# EasyEDA Pro project esp32car.eprj

# Schematic Schematic1
Board Name: Board1; Create Date: 2025-06-29; Page Name: P1; Project Name: esp32car; Schematic Name: Schematic1; Update Date: 2025-07-07; Company: EasyEDA.com; Page Size: A4; Version: V1.0
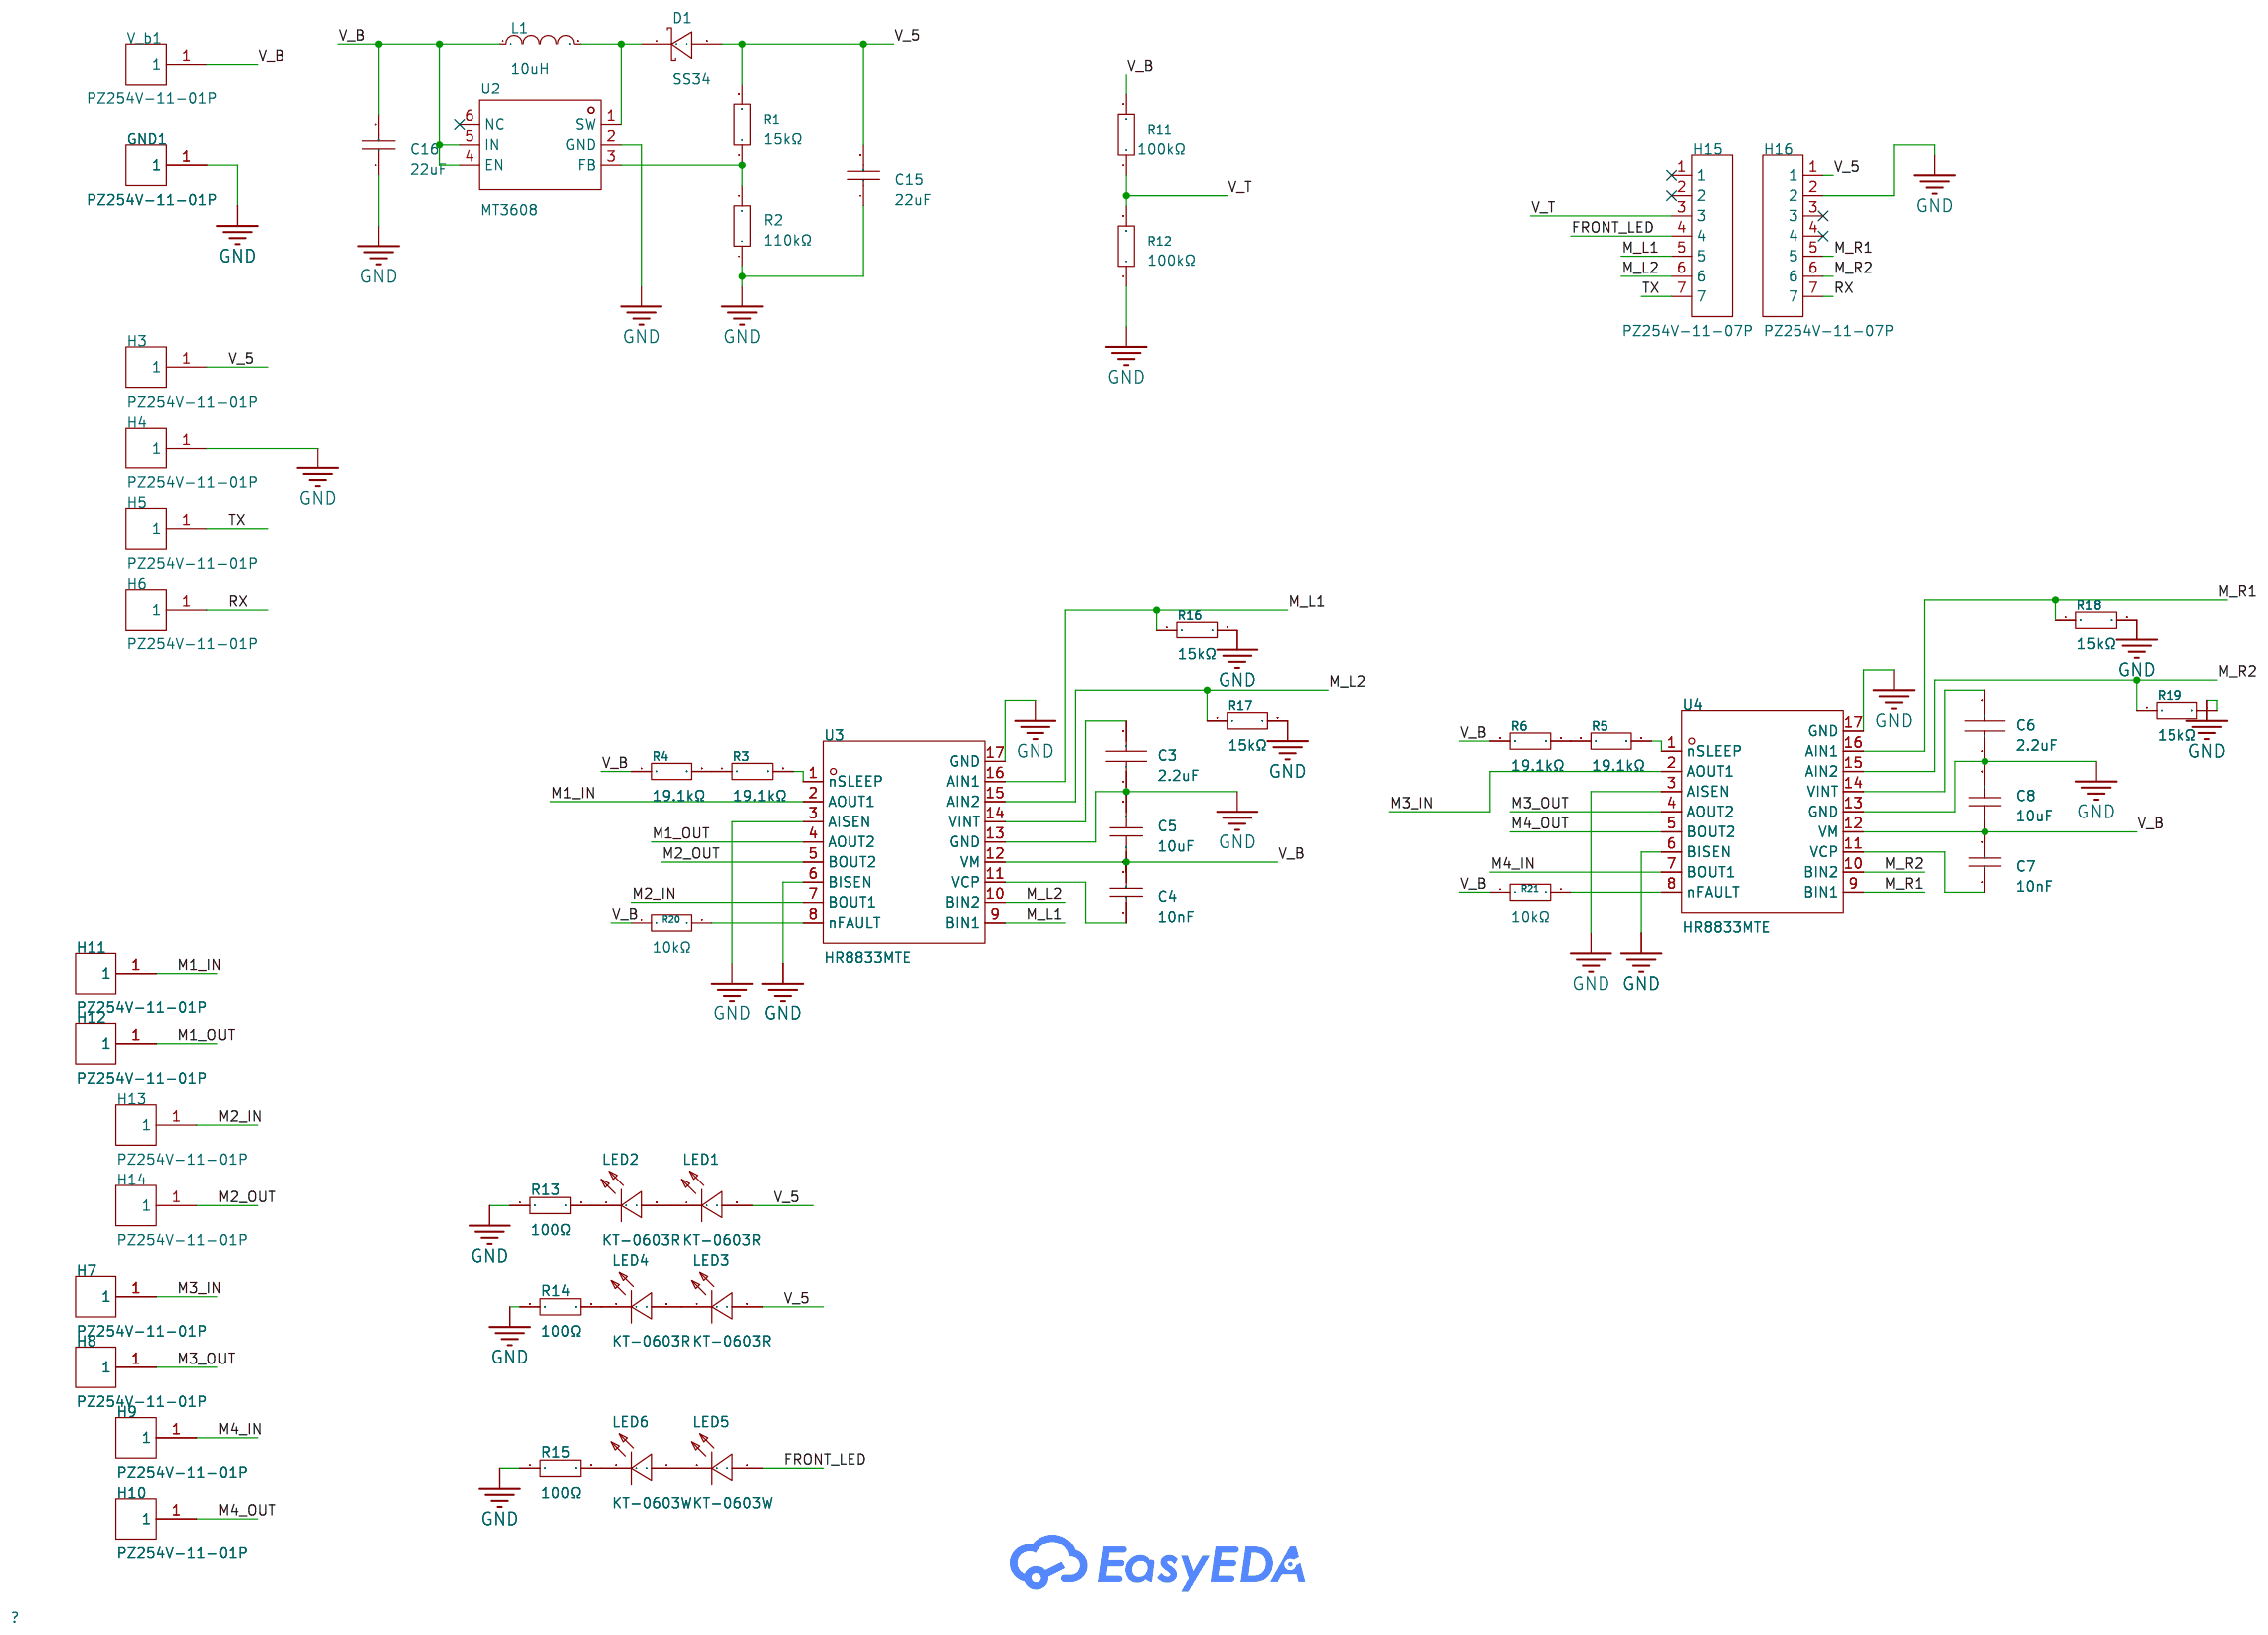
[diagram p0: schematic sheet]

## Parts
C3  2.2uF  [C0402]
C4  10nF  [C0402]
C5  10uF  [C0603]
C6  2.2uF  [C0402]
C7  10nF  [C0402]
C8  10uF  [C0603]
C15  22uF  [C1206]
C16  22uF  [C1206]
D1  SS34  [SMA_L4.3-W2.6-LS5.2-RD]
GND1  PZ254V-11-01P  [TESTPOINT-SMD_BD2.0-H10.5]
H3  PZ254V-11-01P  [TESTPOINT-SMD_BD2.0-H10.5]
H4  PZ254V-11-01P  [TESTPOINT-SMD_BD2.0-H10.5]
H5  PZ254V-11-01P  [TESTPOINT-SMD_BD2.0-H10.5]
H6  PZ254V-11-01P  [TESTPOINT-SMD_BD2.0-H10.5]
H7  PZ254V-11-01P  [TESTPOINT-SMD_BD2.0-H10.5]
H8  PZ254V-11-01P  [TESTPOINT-SMD_BD2.0-H10.5]
H9  PZ254V-11-01P  [TESTPOINT-SMD_BD2.0-H10.5]
H10  PZ254V-11-01P  [TESTPOINT-SMD_BD2.0-H10.5]
H11  PZ254V-11-01P  [TESTPOINT-SMD_BD2.0-H10.5]
H12  PZ254V-11-01P  [TESTPOINT-SMD_BD2.0-H10.5]
H13  PZ254V-11-01P  [TESTPOINT-SMD_BD2.0-H10.5]
H14  PZ254V-11-01P  [TESTPOINT-SMD_BD2.0-H10.5]
H15  PZ254V-11-07P  [HDR-TH_7P-P2.54-V-M]
H16  PZ254V-11-07P  [HDR-TH_7P-P2.54-V-M]
L1  10uH  [L1008]
LED1  KT-0603R  [LED0603-RD]
LED2  KT-0603R  [LED0603-RD]
LED3  KT-0603R  [LED0603-RD]
LED4  KT-0603R  [LED0603-RD]
LED5  KT-0603W  [LED0603-R-RD_WHITE]
LED6  KT-0603W  [LED0603-R-RD_WHITE]
R1  15kΩ  [R0402]
R2  110kΩ  [R0603]
R3  19.1kΩ  [R0402]
R4  19.1kΩ  [R0402]
R5  19.1kΩ  [R0402]
R6  19.1kΩ  [R0402]
R11  100kΩ  [R0402]
R12  100kΩ  [R0402]
R13  100Ω  [R0402]
R14  100Ω  [R0402]
R15  100Ω  [R0402]
R16  15kΩ  [R0402]
R17  15kΩ  [R0402]
R18  15kΩ  [R0402]
R19  15kΩ  [R0402]
R20  10kΩ  [R0603]
R21  10kΩ  [R0603]
U2  MT3608  [SOT-23-6_L2.9-W1.6-P0.95-LS2.8-BL]
U3  HR8833MTE  [TSSOP-16_L5.0-W4.4-P0.65-LS6.4-BL-EP3.0]
U4  HR8833MTE  [TSSOP-16_L5.0-W4.4-P0.65-LS6.4-BL-EP3.0]
V_b1  PZ254V-11-01P  [TESTPOINT-SMD_BD2.0-H10.5]

## Library data of the parts
C3 C6 = CL05A225MQ5NSNC: Capacitance: Tolerance:±20% Tolerance:±20% Voltage Rated: Temperature Coefficient:; LCSC Part Name: 2.2uF ±20% 6.3V; Supplier Part: C12530; Manufacturer: SAMSUNG(三星); Supplier Footprint: 0402; JLCPCB Part Class: Basic Part; Datasheet: https://atta.szlcsc.com/upload/public/pdf/source/20160218/1457707763339.pdf; Supplier: LCSC; Tolerance: ±20%; Check: true
C4 C7 = CL05B103KB5NNNC: Capacitance: Tolerance:±10% Tolerance:±10% Voltage Rated: Temperature Coefficient:; LCSC Part Name: 10nF ±10% 50V; Supplier Part: C15195; Manufacturer: SAMSUNG(三星); Supplier Footprint: 0402; JLCPCB Part Class: Basic Part; Datasheet: https://atta.szlcsc.com/upload/public/pdf/source/20160218/1457707763339.pdf; Supplier: LCSC; Tolerance: ±10%; Check: true
C5 C8 = CL10A106KP8NNNC: Capacitance: Tolerance:±10% Tolerance:±10% Voltage Rated: Temperature Coefficient:; LCSC Part Name: 10uF ±10% 10V; Supplier Part: C19702; Manufacturer: SAMSUNG(三星); Supplier Footprint: 0603; JLCPCB Part Class: Basic Part; Datasheet: https://atta.szlcsc.com/upload/public/pdf/source/20160218/1457707763339.pdf; Supplier: LCSC; Tolerance: ±10%; Check: true
C15 C16 = 1206X226K100NT: Capacitance:22uF Tolerance:±10% Tolerance:±10% Voltage Rating:10V Temperature Coefficient:X5R; LCSC Part Name: 22uF ±10% 10V; Supplier Part: C1859; Manufacturer: FH(风华); Supplier Footprint: 1206; JLCPCB Part Class: Extended Part; Datasheet: https://atta.szlcsc.com/upload/public/pdf/source/20200305/C486355_26A10D38EF8C2A5C37091D0039909270.pdf; Supplier: LCSC; Tolerance: ±10%; Voltage Rating: 10V; Temperature Coefficient: X5R; Check: true
D1 = SS34_C8678: Diode Configuration:Independent Type Forward Voltage (Vf@If):550mV@3A Reverse Voltage (Vr):40V Rectified Current:3A Reverse Leakage Current (Ir):500uA@40V; LCSC Part Name: 电压:40V 电流:3A; Supplier Part: C8678; Manufacturer: MDD(辰达半导体); Supplier Footprint: SMA(DO-214AC); JLCPCB Part Class: Basic Part; Datasheet: https://atta.szlcsc.com/upload/public/pdf/source/20240710/2118BB86FDDB2E0B294389AC1F3F65C8.pdf; Supplier: LCSC; Diode Configuration: Independent Type; Forward Voltage (Vf@If): 550mV@3A; Reverse Voltage (Vr): 40V; Rectified Current: 3A; Reverse Leakage Current (Ir): 500uA@40V; Check: true
GND1 H3-H14 V_b1 = PZ254V-11-01P: Pin Structure:1x1P Pitch:2.54mm Row Spacing:- Circluar Pins/Square Pins:Policy Mounting Type:Straight Number of Rows:Single Row Number of Pins:1P Current Rating:- Voltage Rating (Max):- Length of Mating Pin:6mm Insulation Height:2.5mm Length of End Connec; LCSC Part Name: 1x1P 间距:2.54mm 方针 直插; Supplier Part: C492400; Manufacturer: XFCN(兴飞); Supplier Footprint: 插件,P=2.54mm; JLCPCB Part Class: Extended Part; Datasheet: https://atta.szlcsc.com/upload/public/pdf/source/20200309/C492400_46876A5B545F5AE6B8D4A09C46E276E8.pdf; Supplier: LCSC; Pin Structure: 1x1P; Pitch: 2.54mm; Circluar Pins/Square Pins: Policy; Mounting Type: Straight; Number of Rows: Single Row; Number of Pins: 1P; Length of Mating Pin: 6mm; Insulation Height: 2.5mm; Length of End Connection Pin: 3mm; Contact Material: Brass; Operating Temperature: -40℃~+105℃; Color: Black; Check: true
H15 H16 = PZ254V-11-07P: Pin Structure:1x7P Pitch:2.54mm Row Spacing:- Circluar Pins/Square Pins:Policy Mounting Type:Straight Number of Rows:Single Row Number of Pins:7P Current Rating:- Voltage Rating (Max):- Length of Mating Pin:6mm Insulation Height:2.5mm Length of End Connec; LCSC Part Name: 1x7P 间距:2.54mm 方针 直插; Supplier Part: C492406; Manufacturer: XFCN(兴飞); Supplier Footprint: 插件,P=2.54mm; JLCPCB Part Class: Extended Part; Datasheet: https://atta.szlcsc.com/upload/public/pdf/source/20200309/C492406_654C533EE691117E22DD9F76C114C2D9.pdf; Supplier: LCSC; Pin Structure: 1x7P; Pitch: 2.54mm; Circluar Pins/Square Pins: Policy; Mounting Type: Straight; Number of Rows: Single Row; Number of Pins: 7P; Length of Mating Pin: 6mm; Insulation Height: 2.5mm; Length of End Connection Pin: 3mm; Contact Material: Brass; Operating Temperature: -40℃~+105℃; Color: Black; Check: true
L1 = MLP2520S100MT0S1: Inductance: Tolerance:±20% Tolerance:±20% Rated Current: Saturation Current (Isat):- DC Resistance (DCR): Q @ Freq:- Frequency - Self Resonant:- Ratings:; LCSC Part Name: 10uH ±20%; Supplier Part: C191565; Manufacturer: TDK; Supplier Footprint: 1008; JLCPCB Part Class: Extended Part; Datasheet: https://atta.szlcsc.com/upload/public/pdf/source/20180509/C191565_96EFA22247937AC23482DD539EC5BC50.pdf; Supplier: LCSC; Tolerance: ±20%; Check: true
LED1-LED4 = KT-0603R: Emitted Color:Red Power Dissipation:- Forward Current:- Dominant Wavelength:- Dominant Wavelength:- Peak Wavelength:- Diode Configuration:- Lens Color:- Color Temperature:- Color Temperature:- Viewing Angle:- Mounting Sytle:- Operating Temperature:-40℃~+8; LCSC Part Name: 0603 红灯 高亮; Supplier Part: C2286; Manufacturer: KENTO; Supplier Footprint: 0603; JLCPCB Part Class: Basic Part; Datasheet: https://atta.szlcsc.com/upload/public/pdf/source/20160616/1466072038404.pdf; Supplier: LCSC; Emitted Color: Red; Operating Temperature: -40℃~+85℃; Check: true
LED5 LED6 = KT-0603W: Emitted Color:White; LCSC Part Name: 0603 白灯 高亮; Supplier Part: C2290; Manufacturer: KENTO; Supplier Footprint: 0603; JLCPCB Part Class: Basic Part; Datasheet: https://atta.szlcsc.com/upload/public/pdf/source/20221101/4C23D5C85BA051E44A00B833D0A41468.pdf; Supplier: LCSC; Emitted Color: White; Check: true
R1 R16-R19 = 0402WGF1502TCE: Type:Thick Film Resistors Resistance:15kΩ Tolerance:±1% Tolerance:±1% Power(Watts): Overload Voltage (Max): Temperature Coefficient:±100ppm/℃ Temperature Coefficient:±100ppm/℃ Operating Temperature Range:-55℃~+155℃ Operating Temperature Range:-55℃~+155℃; LCSC Part Name: 15kΩ ±1% 62.5mW 厚膜电阻; Supplier Part: C25756; Manufacturer: UNI-ROYAL(厚声); Supplier Footprint: 0402; JLCPCB Part Class: Basic Part; Datasheet: https://atta.szlcsc.com/upload/public/pdf/source/20200306/C422600_1E6D84923E4A46A82E41ADD87F860B5C.pdf; Supplier: LCSC; Type: Thick Film Resistors; Tolerance: ±1%; Temperature Coefficient: ±100ppm/℃; Operating Temperature Range: -55℃~+155℃; Check: true
R2 = 0603WAF1103T5E: Type:Thick Film Resistors Resistance:110kΩ Tolerance:±1% Tolerance:±1% Power(Watts): Overload Voltage (Max): Temperature Coefficient:±100ppm/℃ Temperature Coefficient:±100ppm/℃ Operating Temperature Range:-55℃~+155℃ Operating Temperature Range:-55℃~+155℃; LCSC Part Name: 110kΩ ±1% 100mW 厚膜电阻; Supplier Part: C25805; Manufacturer: UNI-ROYAL(厚声); Supplier Footprint: 0603; JLCPCB Part Class: Extended Part; Datasheet: https://atta.szlcsc.com/upload/public/pdf/source/20200306/C422600_1E6D84923E4A46A82E41ADD87F860B5C.pdf; Supplier: LCSC; Type: Thick Film Resistors; Tolerance: ±1%; Temperature Coefficient: ±100ppm/℃; Operating Temperature Range: -55℃~+155℃; Check: true
R3-R6 = 0402WGF1912TCE: Type:Thick Film Resistors Resistance:19.1kΩ Tolerance:±1% Tolerance:±1% Power(Watts): Overload Voltage (Max): Temperature Coefficient:±100ppm/℃ Temperature Coefficient:±100ppm/℃ Operating Temperature Range:-55℃~+155℃ Operating Temperature Range:-55℃~+155℃; LCSC Part Name: 19.1kΩ ±1% 62.5mW 厚膜电阻; Supplier Part: C52036; Manufacturer: UNI-ROYAL(厚声); Supplier Footprint: 0402; JLCPCB Part Class: Extended Part; Datasheet: https://atta.szlcsc.com/upload/public/pdf/source/20200306/C422600_1E6D84923E4A46A82E41ADD87F860B5C.pdf; Supplier: LCSC; Type: Thick Film Resistors; Tolerance: ±1%; Temperature Coefficient: ±100ppm/℃; Operating Temperature Range: -55℃~+155℃; Check: true
R11 R12 = 0402WGF1003TCE: Type:Thick Film Resistors Resistance:100kΩ Tolerance:±1% Tolerance:±1% Power(Watts): Overload Voltage (Max): Temperature Coefficient:±100ppm/℃ Temperature Coefficient:±100ppm/℃ Operating Temperature Range:-55℃~+155℃ Operating Temperature Range:-55℃~+155℃; LCSC Part Name: 100kΩ ±1% 62.5mW 厚膜电阻; Supplier Part: C25741; Manufacturer: UNI-ROYAL(厚声); Supplier Footprint: 0402; JLCPCB Part Class: Basic Part; Datasheet: https://atta.szlcsc.com/upload/public/pdf/source/20200306/C422600_1E6D84923E4A46A82E41ADD87F860B5C.pdf; Supplier: LCSC; Type: Thick Film Resistors; Tolerance: ±1%; Temperature Coefficient: ±100ppm/℃; Operating Temperature Range: -55℃~+155℃; Check: true
R13-R15 = 0402WGF1000TCE: Type:Thick Film Resistors Resistance: Tolerance:±1% Tolerance:±1% Power(Watts): Overload Voltage (Max): Temperature Coefficient:±200ppm/℃ Temperature Coefficient:±200ppm/℃ Operating Temperature Range:-55℃~+155℃ Operating Temperature Range:-55℃~+155℃; LCSC Part Name: 100Ω ±1% 62.5mW 厚膜电阻; Supplier Part: C25076; Manufacturer: UNI-ROYAL(厚声); Supplier Footprint: 0402; JLCPCB Part Class: Basic Part; Datasheet: https://atta.szlcsc.com/upload/public/pdf/source/20200306/C422600_1E6D84923E4A46A82E41ADD87F860B5C.pdf; Supplier: LCSC; Type: Thick Film Resistors; Tolerance: ±1%; Temperature Coefficient: ±200ppm/℃; Operating Temperature Range: -55℃~+155℃; Check: true
R20 R21 = 0603WAF1002T5E: LCSC Part Name: 厚膜电阻 10kΩ ±1% 100mW; Supplier Part: C25804; Manufacturer: UNI-ROYAL(厚声); Supplier Footprint: 0603; JLCPCB Part Class: Basic Part; Datasheet: https://atta.szlcsc.com/upload/public/pdf/source/20200306/C422600_1E6D84923E4A46A82E41ADD87F860B5C.pdf; Supplier: LCSC; Type: Thick Film Resistor; Tolerance: ±1%; Power(Watts): 100mW; Voltage-Supply(Max): 75V; Temperature Coefficient: ±100ppm/℃; Operating Temperature: -55℃~+155℃
U2 = MT3608: Function:Boost type Output Type:Adjustable Input Voltage:2V~24V Input Voltage:2V~24V Output Voltage:28V Output Voltage:28V Output Current:2A Switching Frequency:1.2MHz Switching Frequency:1.2MHz Operating Temperature:-40℃~+85℃ Operating Temperature:-40℃~+; LCSC Part Name: 高效1.2MHz 2A升压转换器; Supplier Part: C84817; Manufacturer: 西安航天民芯; Supplier Footprint: SOT-23-6; JLCPCB Part Class: Extended Part; Datasheet: https://atta.szlcsc.com/upload/public/pdf/source/20161110/1478743351706.pdf; Supplier: LCSC; Function: Boost type; Output Type: Adjustable; Input Voltage: 2V~24V; Output Voltage: 28V; Output Current: 2A; Switching Frequency: 1.2MHz; Operating Temperature: -40℃~+85℃; Synchronous Rectification: No; Number of Outputs: 1; Topology: Boost; Quiescent Current (Iq): 200uA; Switch tube (built-in/external): Built-in; Check: true
U3 U4 = HR8833MTE: Supplier Part: C128666; Manufacturer: 嘉兴禾润; Supplier Footprint: TSSOP-16-EP; JLCPCB Part Class: Extended Part; Supplier: LCSC; Check: true

## Nets
GND: C3.1 C5.2 C6.1 C8.2 C15.1 C16.1 GND1.1 H4.1 H16.2 R2.1 R12.1 R13.1 R14.1 R15.1 R16.2 R17.2 R18.2 R19.2 U2.2(GND) U3.3(AISEN) U3.6(BISEN) U3.13(GND) U3.17(GND) U4.3(AISEN) U4.6(BISEN) U4.13(GND) U4.17(GND)
FRONT_LED: H15.4 LED5.1(A)
M1_IN: H11.1 U3.2(AOUT1)
M1_OUT: H12.1 U3.4(AOUT2)
M2_IN: H13.1 U3.7(BOUT1)
M2_OUT: H14.1 U3.5(BOUT2)
M3_IN: H7.1 U4.2(AOUT1)
M3_OUT: H8.1 U4.4(AOUT2)
M4_IN: H9.1 U4.7(BOUT1)
M4_OUT: H10.1 U4.5(BOUT2)
M_L1: H15.5 R16.1 U3.9(BIN1) U3.16(AIN1)
M_L2: H15.6 R17.1 U3.10(BIN2) U3.15(AIN2)
M_R1: H16.5 R18.1 U4.9(BIN1) U4.16(AIN1)
M_R2: H16.6 R19.1 U4.10(BIN2) U4.15(AIN2)
RX: H6.1 H16.7
TX: H5.1 H15.7
V_5: C15.2 D1.2(A) H3.1 H16.1 LED1.2(A) LED3.2(A) R1.2
V_B: C4.2 C5.1 C7.2 C8.1 C16.2 L1.1 R4.1 R6.1 R11.2 R20.1 R21.1 U2.4(EN) U2.5(IN) U3.12(VM) U4.12(VM) V_b1.1
V_T: H15.3 R11.1 R12.2
$1N6631: R3.2 U3.1(nSLEEP)
$1N6635: R1.1 R2.2 U2.3(FB)
$1N6637: R3.1 R4.2
$1N6639: C3.2 U3.14(VINT)
$1N6644: C4.1 U3.11(VCP)
$1N6652: R5.1 R6.2
$1N6659: R5.2 U4.1(nSLEEP)
$1N6698: LED4.1(K) R14.2
$1N6699: LED3.1(K) LED4.2(A)
$1N6700: LED1.1(K) LED2.2(A)
$1N6701: LED2.1(K) R13.2
$1N6705: LED6.2(K) R15.2
$1N6706: LED5.2(K) LED6.1(A)
$1N6742: C7.1 U4.11(VCP)
$1N6743: C6.2 U4.14(VINT)
$1N6745: D1.1(K) L1.2 U2.1(SW)
$1N6882: R20.2 U3.8(nFAULT)
$1N6931: R21.2 U4.8(nFAULT)

Not connected (* = marked no-connect by the designer): H15 1* 2*; H16 3* 4*; U2 6(NC)*

# Board PCB1
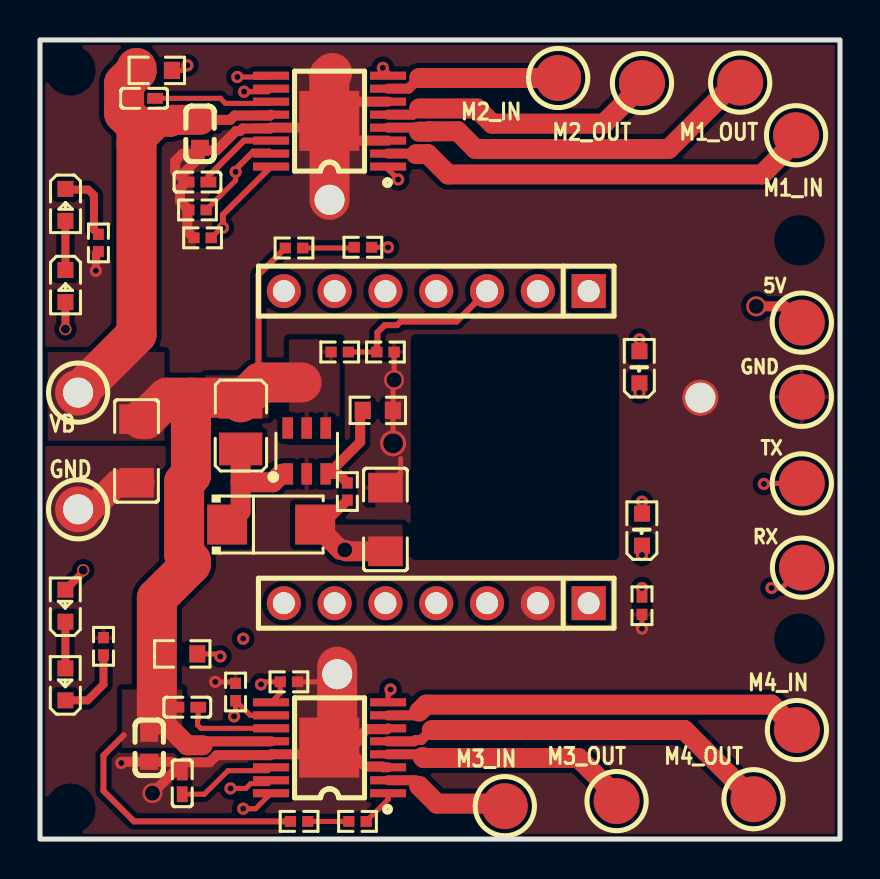
[diagram p1: board, top side]
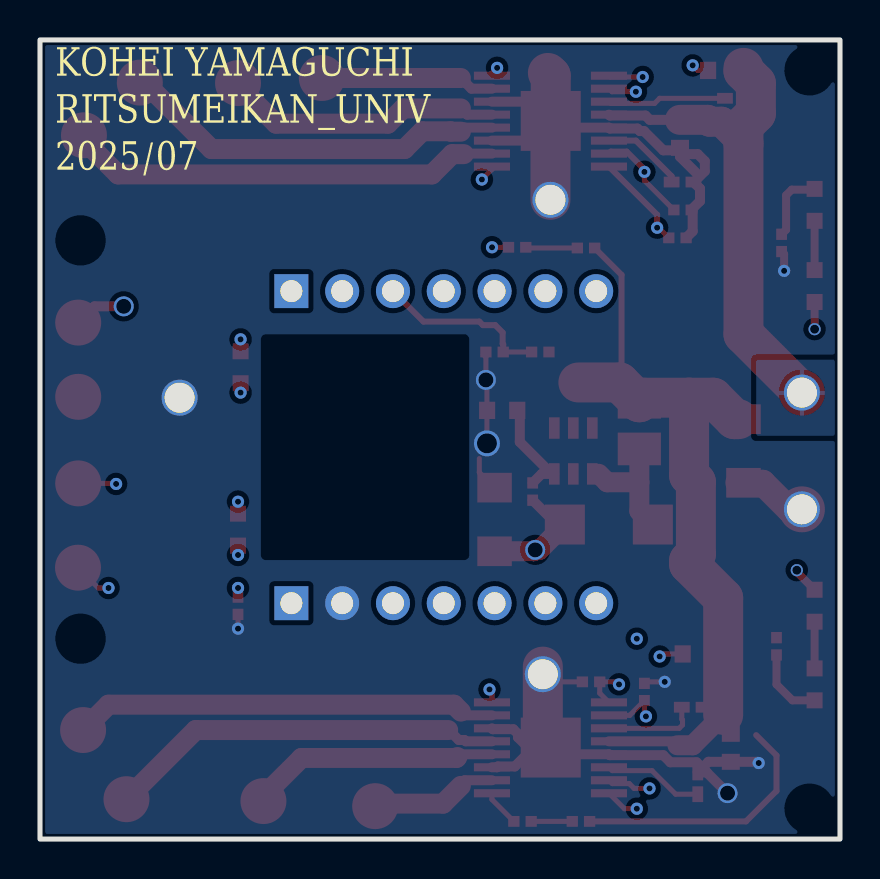
[diagram p2: board, bottom side, seen from below]

Outline 40 x 40 mm; copper layers: Top Layer, Inner1, Inner2, Bottom Layer. Coordinates in mm from the lower left corner of the outline.
Outline path: rectangle 0,40 40,0
Stack: Top Layer 0.035mm Outer layer thickness 1oz / Dielectric1 0.2104mm 7628 RC49% 8.6mil / Inner1 0.0152mm Inner layer thickness / Dielectric2 1.065mm 1.1mm H/HOZ Copper / Inner2 0.0152mm Inner layer thickness / Dielectric3 0.2104mm 7628 RC49% 8.6mil / Bottom Layer 0.035mm Outer layer thickness 1oz

## Design rules (mm)
template: JLCPCB Capability(Two Layers Board)
spacing copperThickness1oz (default): track to track 0.102, other pairs 0.152 to 0.3
spacing copperThickness2oz: track to track 0.203, other pairs 0.152 to 0.3
track width copperThickness1oz (default): min 0.127, default 0.254, max 2.54
track width copperThickness2oz: min 0.203, default 0.254, max 2.54
differential pair differentialPair (default): width min 0.127, default 0.254, max 2.54; gap min 0.152, default 0.152
via viaSize (default): diameter min 0.5, default 0.61, max 10; hole min 0.3, default 0.305, max 6.3

## Placement (name value [footprint] x y rotation side)
5V  PZ254V-11-01P  [TESTPOINT-SMD_BD2.0-H10.5]  38.09 25.85 0 top
C3  2.2uF  [C0402]  7.87 32.89 0 top
C4  10nF  [C0402]  5.21 37.08 180 top
C5  10uF  [C0603]  8 35.3 270 top
C6  2.2uF  [C0402]  7.11 2.79 270 top
C7  10nF  [C0402]  7.37 6.6 180 top
C8  10uF  [C0603]  5.46 4.57 270 top
C15  22uF  [C1206]  17.27 16 270 top
C16  22uF  [C1206]  4.83 19.43 90 top
D1  SS34  [SMA_L4.3-W2.6-LS5.2-RD]  11.56 15.74 0 top
GND  PZ254V-11-01P  [TESTPOINT-SMD_BD2.0-H10.5]  38.09 22.14 0 top
GND1  PZ254V-11-01P  [TESTPOINT-SMD_BD2.0-H10.5]  1.91 16.5 0 top
H7  PZ254V-11-01P  [TESTPOINT-SMD_BD2.0-H10.5]  23.24 1.65 0 top
H8  PZ254V-11-01P  [TESTPOINT-SMD_BD2.0-H10.5]  28.83 1.9 0 top
H9  PZ254V-11-01P  [TESTPOINT-SMD_BD2.0-H10.5]  37.85 5.46 0 top
H10  PZ254V-11-01P  [TESTPOINT-SMD_BD2.0-H10.5]  35.68 1.99 0 top
H11  PZ254V-11-01P  [TESTPOINT-SMD_BD2.0-H10.5]  37.8 35.23 0 top
H12  PZ254V-11-01P  [TESTPOINT-SMD_BD2.0-H10.5]  35.01 37.86 0 top
H13  PZ254V-11-01P  [TESTPOINT-SMD_BD2.0-H10.5]  25.91 38.09 0 top
H14  PZ254V-11-01P  [TESTPOINT-SMD_BD2.0-H10.5]  30.1 37.84 0 top
H15  PZ254V-11-07P  [HDR-TH_7P-P2.54-V-M]  19.81 27.43 180 top
H16  PZ254V-11-07P  [HDR-TH_7P-P2.54-V-M]  19.81 11.81 180 top
L1  10uH  [L1008]  10.03 20.7 270 top
LED1  KT-0603R  [LED0603-RD]  1.27 11.68 90 top
LED2  KT-0603R  [LED0603-RD]  1.27 7.74 90 top
LED3  KT-0603R  [LED0603-RD]  1.27 27.68 270 top
LED4  KT-0603R  [LED0603-RD]  1.27 31.74 270 top
LED5  KT-0603W  [LED0603-R-RD_WHITE]  29.97 23.62 90 top
LED6  KT-0603W  [LED0603-R-RD_WHITE]  30.1 15.49 90 top
NOREF  -  [Pad_e133]  14.86 8.25 0 top
NOREF#2  -  [Pad_e7671]  1.91 22.35 0 top
NOREF#3  -  [Pad_e7670]  1.91 16.5 0 top
NOREF#4  -  [Pad_e134]  14.48 32 0 top
NOREF#5  -  [Pad_e1954]  33.02 22.09 0 top
R1  15kΩ  [R0402]  15.37 17.39 270 top
R2  110kΩ  [R0603]  16.89 21.46 180 top
R3  19.1kΩ  [R0402]  16.14 29.62 0 top
R4  19.1kΩ  [R0402]  12.7 29.59 0 top
R5  19.1kΩ  [R0402]  15.88 0.88 0 top
R6  19.1kΩ  [R0402]  12.95 0.88 0 top
R11  100kΩ  [R0402]  14.99 24.38 180 top
R12  100kΩ  [R0402]  17.27 24.38 180 top
R13  100Ω  [R0402]  3.17 9.65 270 top
R14  100Ω  [R0402]  2.92 29.84 90 top
R15  100Ω  [R0402]  30.1 11.68 90 top
R16  15kΩ  [R0402]  8.13 30.09 180 top
R17  15kΩ  [R0402]  7.87 31.49 180 top
R18  15kΩ  [R0402]  12.45 7.87 0 top
R19  15kΩ  [R0402]  9.78 7.36 90 top
R20  10kΩ  [R0603]  5.84 38.48 0 top
R21  10kΩ  [R0603]  7.11 9.27 0 top
RX  PZ254V-11-01P  [TESTPOINT-SMD_BD2.0-H10.5]  38.1 13.58 0 top
TX  PZ254V-11-01P  [TESTPOINT-SMD_BD2.0-H10.5]  38.09 17.8 0 top
U2  MT3608  [SOT-23-6_L2.9-W1.6-P0.95-LS2.8-BL]  13.33 19.43 0 top
U3  HR8833MTE  [TSSOP-16_L5.0-W4.4-P0.65-LS6.4-BL-EP3.0]  14.48 35.94 90 top
U4  HR8833MTE  [TSSOP-16_L5.0-W4.4-P0.65-LS6.4-BL-EP3.0]  14.48 4.57 90 top
V_b1  PZ254V-11-01P  [TESTPOINT-SMD_BD2.0-H10.5]  1.91 22.35 0 top

## Footprints (pads in the part's own frame, mm; a bottom-side part is the same pattern mirrored in y, then rotated)
C0402
  rect 0.79x0.54 smd: 1(-0.545,0) 2(0.545,0)
C0603
  rect 0.8x0.9 smd: 1(-0.7,0) 2(0.7,0)
C1206
  rect 1.485x1.728 smd: 1(-1.593,0) 2(1.593,0)
HDR-TH_7P-P2.54-V-M
  rect 1.7x1.7 hole 1.1: 1(-7.62,0)
  round 1.7 hole 1.1: 2(-5.08,0) 3(-2.54,0) 4(0,0) 5(2.54,0) 6(5.08,0) 7(7.62,0)
L1008
  rect 1.635x2.16 smd: 1(-1.167,0) 2(1.167,0)
LED0603-R-RD_WHITE
  rect 0.8x0.8 smd: 1(0.8,0) 2(-0.8,0)
LED0603-RD
  rect 0.8x0.8 smd: 1(-0.799,0) 2(0.799,0)
Pad_e133
  round 1.8 hole 1.5: 1(0,0)
Pad_e134
  round 1.8 hole 1.5: 1(0,0)
Pad_e1954
  round 1.8 hole 1.5: 1(0,0)
Pad_e7670
  round 1.8 hole 1.5: 1(0,0)
Pad_e7671
  round 1.8 hole 1.5: 2(0,0)
R0402
  rect 0.566x0.54 smd: 1(-0.433,0) 2(0.433,0)
R0603
  rect 0.806x0.864 smd: 1(-0.753,0) 2(0.753,0)
SMA_L4.3-W2.6-LS5.2-RD
  rect 2x2 smd: 1(-2.2,0) 2(2.2,0)
SOT-23-6_L2.9-W1.6-P0.95-LS2.8-BL
  rect 0.532x1.072 smd: 1(-0.95,-1.149) 2(0,-1.149) 3(0.95,-1.149) 4(0.95,1.149) 5(0,1.149) 6(-0.95,1.149)
TESTPOINT-SMD_BD2.0-H10.5
  round 2.3 smd: 1(0,0)
TSSOP-16_L5.0-W4.4-P0.65-LS6.4-BL-EP3.0
  rect 0.406x1.804 smd: 1(-2.275,-2.925) 2(-1.625,-2.925) 3(-0.975,-2.925) 4(-0.325,-2.925) 5(0.325,-2.925) 6(0.975,-2.925) 7(1.625,-2.925) 8(2.275,-2.925) 9(2.275,2.925) 10(1.625,2.925) 11(0.975,2.925) 12(0.325,2.925) 13(-0.325,2.925) 14(-0.975,2.925) 15(-1.625,2.925) 16(-2.275,2.925)
  rect 3x3 smd: 17(0.012,0.015)

## Nets
As in the schematic, except:
GND: C3.1 C5.2 C6.1 C8.2 C15.1 C16.1 GND.1 GND1.1 H16.2 NOREF.1 NOREF#3.1 NOREF#4.1 NOREF#5.1 R2.1 R12.1 R13.1 R14.1 R15.1 R16.2 R17.2 R18.2 R19.2 U2.2 U3.3 U3.6 U3.13 U3.17 U4.3 U4.6 U4.13 U4.17
RX: H16.7 RX.1
TX: H15.7 TX.1
V_5: 5V.1 C15.2 D1.2 H16.1 LED1.2 LED3.2 R1.2
V_B: C4.2 C5.1 C7.2 C8.1 C16.2 L1.1 NOREF#2.2 R4.1 R6.1 R11.2 R20.1 R21.1 U2.4 U2.5 U3.12 U4.12 V_b1.1

Pads without a net: H15 1 2; H16 3 4; U2 6

## Via types
v1: diameter 1, hole 0.75, Top Layer to Bottom Layer, 4 vias
v2: diameter 0.61, hole 0.305, Top Layer to Bottom Layer, 26 vias
v3: diameter 1.3, hole 1, Top Layer to Bottom Layer, 1 via
v4: diameter 0.61, hole 0.45, Top Layer to Bottom Layer, 2 vias

## Routing (per net, layer and track width the routed paths; a pad name or vN(x,y) marks a point on that pad's centre or on a via; arc(x,y) is an arc through that point)
GND: length 64.3
  Top Layer w0.254: 17.83,24.25 17.7,24.12 v1(17.7,22.98) 17.65,22.93 v3(17.65,19.81) ; 17.83,24.25 R12.1 17.83,24.25 ; R15.1 v2(30.1,10.53) ; 18.03,19.04 18.03,18.35 C15.1 ; R18.2 13.97,7.87 ; 15.45,34.96 14.48,35.93 ; v2(8.76,7.87) 9.7,7.87 R19.2 ; 15.57,4.58 U4.17
  Top Layer w0.4: v2(2.79,28.44) 2.79,29.28 R14.1
  Top Layer w0.5: C5.2 7.69,34.28 7.11,34.28 6.76,33.93 6.76,33.43 7.3,32.89 C3.1 7,32.56 7,31.93 R17.2 7.37,31.42 7.37,30.42 R16.2 ; C5.2 8,34.16 7.24,33.4 ; C5.2 8.13,34.47 8.83,34.47 9.8,35.44 10,35.44 10.13,35.57 11.51,35.57 U3.13 14.13,35.61 U3.17 15.43,36.91 U3.6 ; 6.89,3.56 C6.1 6.66,3.33 ; 6.89,3.56 6.58,3.87 C8.2 4.13,3.87 v2(4.06,3.8) ; 6.89,3.56 7.17,3.84 8.48,3.84 8.84,4.2 11.51,4.2 U4.13 14.13,4.24 ; 6.89,3.56 6.66,3.33 ; U4.3 17.15,3.59 17.11,3.63 16.26,3.63 15.57,4.32 ; 6.66,3.33 v1(5.62,2.3) ; U4.6 17.36,5.5 16.33,5.5 16.1,5.26 16.1,5.09 15.59,4.58 15.57,4.58 ; U3.3 15.45,34.96
  Top Layer w1.3: 5.08,17.83 3.87,17.83 2.54,16.5 NOREF#3.1
  Top Layer w2: 14.48,35.93 NOREF#4.1 ; 14.6,38.35 14.46,38.21 U3.17 ; 14.86,4.97 14.86,8.63
FRONT_LED: length 11.8
  Top Layer w0.254: LED5.1 v2(29.97,25.01)
  Inner1 w0.254: H15.4 21.95,25.29 28.82,25.29 29.1,25.01 v2(29.97,25.01)
M1_IN: length 21.8
  Top Layer w0.5: U3.2 18.54,34.31
  Top Layer w1: 18.81,34.28 19.39,34.28 20.4,33.27 36.1,33.27 38.18,35.36
M1_OUT: length 20
  Top Layer w0.5: 19.47,35.43 18.74,35.61 U3.4
  Top Layer w1: 35.01,38.12 31.43,34.54 21.78,34.54 20.89,35.43 19.47,35.43 19.45,35.41 18.96,35.41
M2_IN: length 8.7
  Top Layer w0.5: U3.7 18.43,37.56 18.71,37.84 18.71,37.84 18.96,38.09
  Top Layer w1: 18.96,38.09 H13.1
M2_OUT: length 14.1
  Top Layer w0.5: 18.96,36.57 18.65,36.26 U3.5
  Top Layer w1: H14.1 30.1,37.71 28.19,35.81 22.61,35.81 21.84,36.57 18.96,36.57
M3_IN: length 6
  Top Layer w0.5: 18.77,2.92 18.77,2.94 U4.2
  Top Layer w1: 18.96,2.66 19.85,1.77 23.24,1.77
M3_OUT: length 12.5
  Top Layer w0.5: U4.4 19.08,4.24 19.13,4.29
  Top Layer w1: 19.13,4.1 19.18,4.06 26.92,4.06 28.83,2.15 H8.1
M4_IN: length 21.2
  Top Layer w0.5: 18.96,6.38 18.77,6.19 U4.7
  Top Layer w1: 18.96,6.38 19.3,6.73 36.58,6.73 H9.1
M4_OUT: length 19.7
  Top Layer w0.5: U4.5 18.71,4.89 18.78,4.96 19.06,4.96 19.43,5.33
  Top Layer w1: H10.1 32.22,5.46 19.59,5.46
M_L1: length 28.9
  Top Layer w0.254: v2(9.87,38.15) 11.49,38.15 U3.9 ; v2(9.14,30.6) 9.07,30.6 R16.1
  Top Layer w0.3: U3.16 9.14,31.25 v2(9.14,30.6)
  Inner1 w0.254: v2(9.87,38.15) 9.14,37.42 v2(9.14,30.6) 9.14,26.54 10.54,25.14 16.38,25.14 17.27,26.03 H15.5
M_L2: length 23.8
  Top Layer w0.254: R17.1 9.78,32.96 v2(9.78,33.4) ; U3.10 11.4,37.41 v2(10.21,37.41)
  Top Layer w0.3: U3.15 11.45,34.41 10.67,34.41 9.78,33.52 v2(9.78,33.4)
  Inner1 w0.254: v2(10.21,37.41) 10.21,33.82 ; 10.21,33.82 v2(9.78,33.4) ; 10.21,33.82 10.33,33.7 10.37,33.7 10.37,31.64 10.03,31.31 10.03,26.16 10.29,25.9 12.45,25.9 13.97,27.43 14.73,27.43
M_R1: length 23
  Top Layer w0.254: 11.55,6.84 12.01,7.3 R18.1 11.18,7.87 v2(11.05,7.74) ; U4.16 10.78,1.52 v2(10.16,1.52)
  Inner1 w0.254: 10.92,7.61 10.92,13.08 11.1,13.26 15.82,13.26 H16.5 ; 10.92,7.61 10.41,7.11 10.41,1.77 v2(10.16,1.52) ; 10.92,7.61 v2(11.05,7.74)
M_R2: length 18.2
  Top Layer w0.254: v2(9.7,6.14) 9.78,6.21 9.78,6.93 10.51,6.19 U4.10 ; U4.15 11.38,2.77 10.54,2.77 10.3,2.53 v2(9.52,2.53)
  Inner1 w0.254: v2(10.16,10.03) 9.7,9.57 v2(9.7,6.14) 9.7,2.71 v2(9.52,2.53)
  Inner2 w0.254: v2(10.16,10.03) 12.95,10.03 14.73,11.81
RX: length 28.9
  Top Layer w0.254: RX.1 37.08,12.57 v2(36.58,12.57)
  Inner1 w0.254: H16.7 12.65,11.35 12.65,10.21 12.83,10.03 29.78,10.03 29.86,9.95 33.96,9.95 v2(36.58,12.57)
TX: length 33
  Top Layer w0.254: TX.1 36.22,17.8 v2(36.19,17.77)
  Inner1 w0.254: H15.7 13.46,28.7 28.83,28.7 34.67,22.85 34.67,19.3 v2(36.19,17.77)
V_5: length 11.5
  Top Layer w0.4: v4(2.16,13.46) 2.16,13.37 LED1.2 ; LED3.2 v4(1.27,25.52)
  Top Layer w0.5: 5V.1 37.28,26.66 v1(35.81,26.66) ; D1.2 14.15,15.74 R1.2
  Top Layer w1: C15.2 15.31,14.4 v1(15.24,14.47) 15.03,14.47 D1.2
V_B: length 77.4
  Top Layer w0.3: R4.1 10.92,28.24 10.92,23.36 ; R6.1 4.7,0.88 3.17,2.41 3.17,4.19 4.19,5.2
  Top Layer w0.5: 8.13,4.89 U4.12 ; C5.1 9.51,36 9.73,36.22 11.51,36.22 U3.12
  Top Layer w1: 5.84,6.22 7.37,4.69 8.13,4.69
  Top Layer w1.5: C5.1 6.61,36 6.52,35.91 5.92,35.91 4.83,34.81
  Top Layer w2: 7.55,22.09 6.35,22.09 5.28,21.02 5.08,21.02 ; 7.55,22.09 9.8,22.09 L1.1 11.02,22.85 13.08,22.85 ; 7.55,22.09 7.55,18.21 7.2,17.87 7.2,14.27 7.55,13.92 7.55,13.76 5.84,12.06 5.84,6.22 ; 4.83,38.6 4.83,38.45 4.2,37.83 4.2,36.33 4.83,35.71 4.83,25.27 NOREF#2.2
V_T: length 8.8
  Top Layer w0.254: R11.1 R12.2
  Top Layer w0.3: 22.35,27.43 20.83,25.9 18.03,25.9 17.86,25.72 17.24,25.72 16.87,25.35 16.87,24.79 16.84,24.76 R12.2
$1N6631: length 5.3
  Top Layer w0.254: R3.2 v2(17.4,29.62) ; U3.1 17.4,33.52 v2(17.91,33.01)
  Inner1 w0.254: v2(17.91,33.01) 17.91,30.13 v2(17.4,29.62)
$1N6635: length 5.2
  Top Layer w0.5: U2.3 14.41,18.28 ; 14.41,18.28 14.92,18.28 R1.1 ; 14.41,18.28 16.01,19.88 16.01,21.33 R2.2
$1N6637: length 2.6
  Top Layer w0.254: R3.1 15.67,29.59 R4.2
$1N6639: length 4.2
  Top Layer w0.3: U3.14 10.2,34.96 8.42,33.18 C3.2
$1N6644: length 5.9
  Top Layer w0.254: C4.1 9.02,37.08 9.27,36.82 11.47,36.82 U3.11
$1N6652: length 2.1
  Top Layer w0.254: R6.2 15.44,0.88
$1N6659: length 1.9
  Top Layer w0.254: U4.1 17.4,1.98 R5.2
$1N6698: length 3.6
  Top Layer w0.4: LED4.1 1.31,32.51 2.41,32.51 2.7,32.22 2.7,30.5 R14.2
$1N6699: length 2.5
  Top Layer w0.4: LED3.1 LED4.2
$1N6700: length 2.3
  Top Layer w0.4: LED2.2 LED1.1
$1N6701: length 3.7
  Top Layer w0.4: LED2.1 2.38,6.94 3.17,7.74 R13.2
$1N6705: length 2.6
  Top Layer w0.254: LED6.2 v2(30.1,14.22) ; R15.2 v2(30.1,12.57)
  Inner1 w0.254: v2(30.1,14.22) v2(30.1,12.57)
$1N6706: length 6.6
  Top Layer w0.254: LED5.2 v2(29.97,22.35) ; LED6.1 v2(30.1,16.89)
  Inner1 w0.254: v2(29.97,22.35) 29.97,17.01 v2(30.1,16.89)
$1N6742: length 4.7
  Top Layer w0.254: C7.1 7.91,6 7.87,5.96 7.87,5.71 8.04,5.54 U4.11
$1N6743: length 5
  Top Layer w0.254: C6.2 8.22,2.24 9.4,3.42 11.38,3.42 U4.14
$1N6745: length 6.3
  Top Layer w1: L1.2 10.03,17.86 ; 10.03,17.86 10.03,16.42 D1.1 ; 10.03,17.86 11.64,17.86 12.06,18.28
$1N6882: length 11.2
  Top Layer w0.254: U3.8 17.4,38.34 v2(17.14,38.6) ; R20.2 7.11,38.48 v2(7.37,38.73)
  Inner1 w0.254: v2(17.14,38.6) 17.02,38.73 v2(7.37,38.73)
$1N6931: length 12.5
  Top Layer w0.254: v2(17.53,7.49) 17.4,7.36 17.4,6.84 ; R21.2 8.89,9.27 v2(9.02,9.14)
  Inner2 w0.254: v2(9.02,9.14) 13.33,9.14 14.1,9.9 16.51,9.9 17.53,8.88 v2(17.53,7.49)

## Copper pours and planes (outline as drawn; the poured copper is in the pictures)
GND on Top Layer: 12.71,7.4 16.21,7.4 16.21,1.75 12.71,1.75
GND on Top Layer: 23.69,13.01 26.1,13.01 26.1,10.6 23.69,10.6
GND on Top Layer: 13.65,9.47 16.06,9.47 16.06,7.06 13.65,7.06
GND on Top Layer: 0.39,18.02 3.42,18.02 3.42,14.99 0.39,14.99
GND on Top Layer: 4.44,4.29 6.17,4.29 6.17,2.92 4.44,2.92
GND on Top Layer: 3.56,19.04 5.84,19.04 5.84,15.87 3.56,15.87
GND on Top Layer: 6.3,3.87 7.87,3.87 7.87,3.04 6.3,3.04
GND on Top Layer: 13.11,33.37 15.85,33.37 15.85,30.63 13.11,30.63
GND on Top Layer: 12.73,38.87 16.23,38.87 16.23,33.22 12.73,33.22
GND on Top Layer: 31.65,23.46 34.39,23.46 34.39,20.72 31.65,20.72
GND on Top Layer: 6.48,34.54 7.65,34.54 7.65,28.99 6.48,28.99
GND on Top Layer: 17.26,22.85 18.41,22.85 18.41,20.14 17.26,20.14
GND on Top Layer: 16.76,19.33 18.41,19.33 18.41,16 16.76,16
GND on Top Layer: -1.64,40.51 41.27,40.51 41.27,-1.02 -1.64,-1.02
GND on Bottom Layer: 13.49,9.62 16.23,9.62 16.23,6.88 13.49,6.88
GND on Bottom Layer: 13.17,33.3 15.78,33.3 15.78,30.7 13.17,30.7
GND on Bottom Layer: 0.37,18.42 3.95,18.42 3.95,14.84 0.37,14.84
GND on Bottom Layer: -0.64,40.13 40.77,40.13 40.77,-1.15 -0.64,-1.15
GND on Bottom Layer: 31.72,23.4 34.32,23.4 34.32,20.79 31.72,20.79
GND on Bottom Layer: 23.59,13.11 26.2,13.11 26.2,10.5 23.59,10.5
GND on Inner1: 0.3,18.11 3.51,18.11 3.51,14.9 0.3,14.9
GND on Inner1: 23.64,13.06 26.15,13.06 26.15,10.55 23.64,10.55
GND on Inner1: 13.17,33.3 15.78,33.3 15.78,30.69 13.17,30.69
GND on Inner1: 13.58,9.54 16.13,9.54 16.13,6.98 13.58,6.98
GND on Inner1: -2.29,41.27 41.78,41.27 41.78,-1.53 -2.29,-1.53
GND on Inner1: 31.08,23.26 34.07,23.26 34.07,20.27 31.08,20.27
V_5 on Top Layer: 14.58,15.74 18.13,15.74 18.13,14.4 14.58,14.4
V_5 on Inner2: 26.16,13.06 28.7,13.06 28.7,10.56 26.16,10.56
V_5 on Inner2: -1.78,40.89 40.89,40.89 40.89,-2.8 -1.78,-2.8
V_B on Top Layer: 6.86,36.57 8.89,36.57 8.89,35.55 6.86,35.55
V_B on Top Layer: 0.38,24.38 6.22,24.38 6.22,19.93 0.38,19.93
V_B on Top Layer: 5.08,10.28 6.73,10.28 6.73,8.12 5.08,8.12
V_B on Top Layer: 8.28,23.21 11.43,23.21 11.43,21.08 8.28,21.08
V_B on Top Layer: 12.45,25.01 14.99,25.01 14.99,19.98 12.45,19.98
V_B on Top Layer: 4.1,7.49 7.11,7.49 7.11,4.57 4.1,4.57
V_B on Bottom Layer: 0.25,24 4.19,24 4.19,20.19 0.25,20.19

Small or netless copper shapes (teardrops, artwork), in the pictures only: 1 on Top Layer

## Text on the board
Bottom Silkscreen Layer: KOHEI YAMAGUCHI / RITSUMEIKAN_UNIV / 2025/07
Top Silkscreen Layer: VB | GND | M3_IN | M2_IN | M3_OUT | M2_OUT | M4_OUT | M1_OUT | M4_IN | M1_IN
